# EAGLE design STM32DiscoveryValueLine (EAGLE 6.4)
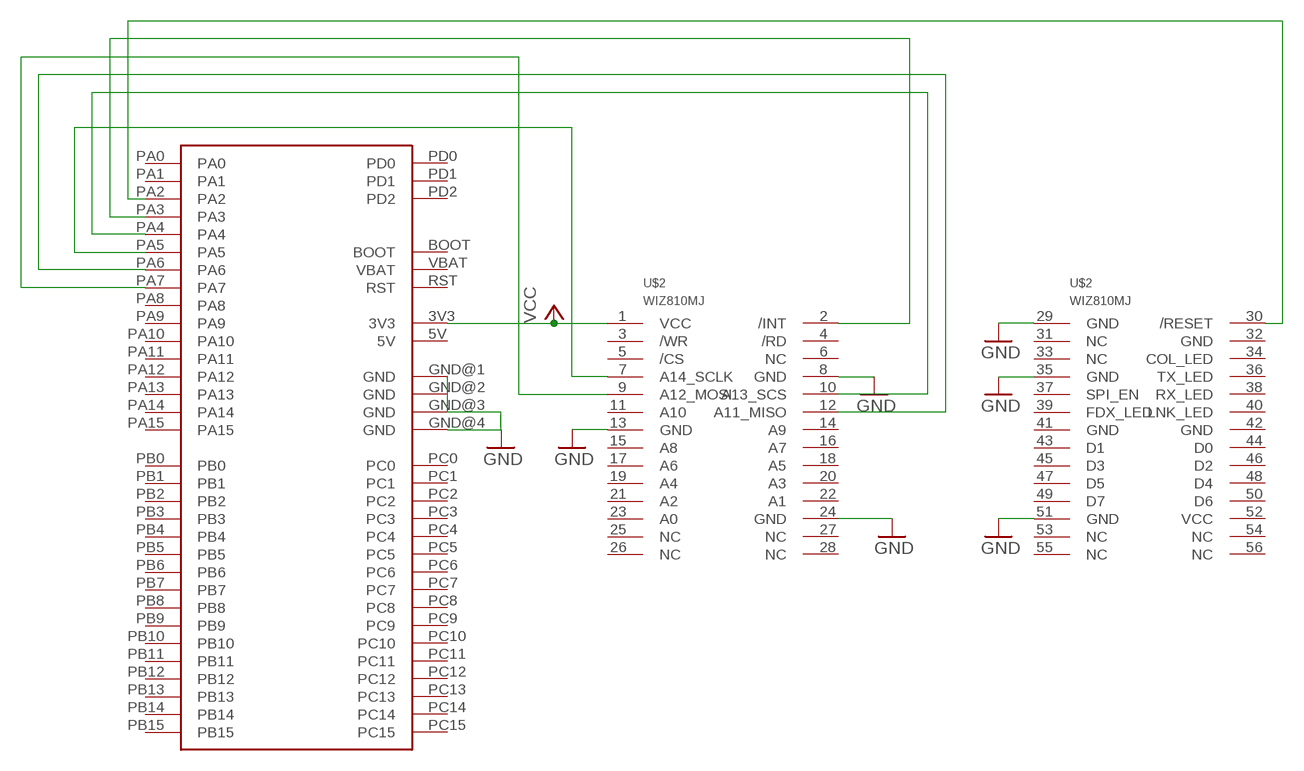
[diagram p0: schematic, sheet 1]

## Parts
U$1  STM32_DISCOVERY  [STM32_DISCOVERY]
U$2  WIZ810MJ  [WIZ810MJ]

## Nets
GND: U$1.GND@1(GND) U$1.GND@2(GND) U$1.GND@3(GND) U$1.GND@4(GND) U$2.8(GND) U$2.13(GND) U$2.24(GND) U$2.29(GND) U$2.35(GND) U$2.51(GND)
N$1: U$1.PA4 U$2.10(A13_SCS)
N$2: U$1.PA5 U$2.7(A14_SCLK)
N$3: U$1.PA6 U$2.12(A11_MISO)
N$4: U$1.PA7 U$2.9(A12_MOSI)
N$5: U$1.PA3 U$2.2(/INT)
N$6: U$1.PA2 U$2.30(/RESET)
VCC: U$1.3V3 U$2.1(VCC)
Unconnected: U$1.5V U$1.BOOT U$1.NC@1(NC) U$1.NC@2(NC) U$1.PA0 U$1.PA1 U$1.PA8 U$1.PA9 U$1.PA10 U$1.PA11 U$1.PA12 U$1.PA13 U$1.PA14 U$1.PA15 U$1.PB0 U$1.PB1 U$1.PB2 U$1.PB3 U$1.PB4 U$1.PB5 U$1.PB6 U$1.PB7 U$1.PB8 U$1.PB9 U$1.PB10 U$1.PB11 U$1.PB12 U$1.PB13 U$1.PB14 U$1.PB15 U$1.PC0 U$1.PC1 U$1.PC2 U$1.PC3 U$1.PC4 U$1.PC5 U$1.PC6 U$1.PC7 U$1.PC8 U$1.PC9 U$1.PC10 U$1.PC11 U$1.PC12 U$1.PC13 U$1.PC14 U$1.PC15 U$1.PD0 U$1.PD1 U$1.PD2 U$1.RST U$1.VBAT U$2.3(/WR) U$2.4(/RD) U$2.5(/CS) U$2.6(NC) U$2.11(A10) U$2.14(A9) U$2.15(A8) U$2.16(A7) U$2.17(A6) U$2.18(A5) U$2.19(A4) U$2.20(A3) U$2.21(A2) U$2.22(A1) U$2.23(A0) U$2.25(NC) U$2.26(NC) U$2.27(NC) U$2.28(NC) U$2.31(NC) U$2.32(GND) U$2.33(NC) U$2.34(COL_LED) U$2.36(TX_LED) U$2.37(SPI_EN) U$2.38(RX_LED) U$2.39(FDX_LED) U$2.40(LNK_LED) U$2.41(GND) U$2.42(GND) U$2.43(D1) U$2.44(D0) U$2.45(D3) U$2.46(D2) U$2.47(D5) U$2.48(D4) U$2.49(D7) U$2.50(D6) U$2.52(VCC) U$2.53(NC) U$2.54(NC) U$2.55(NC) U$2.56(NC)

## Library data of the parts
U$1 = stm32_discovery:STM32_DISCOVERY: STM32 Value line discovery
U$2 = WIZNET:WIZ810MJ

## Board
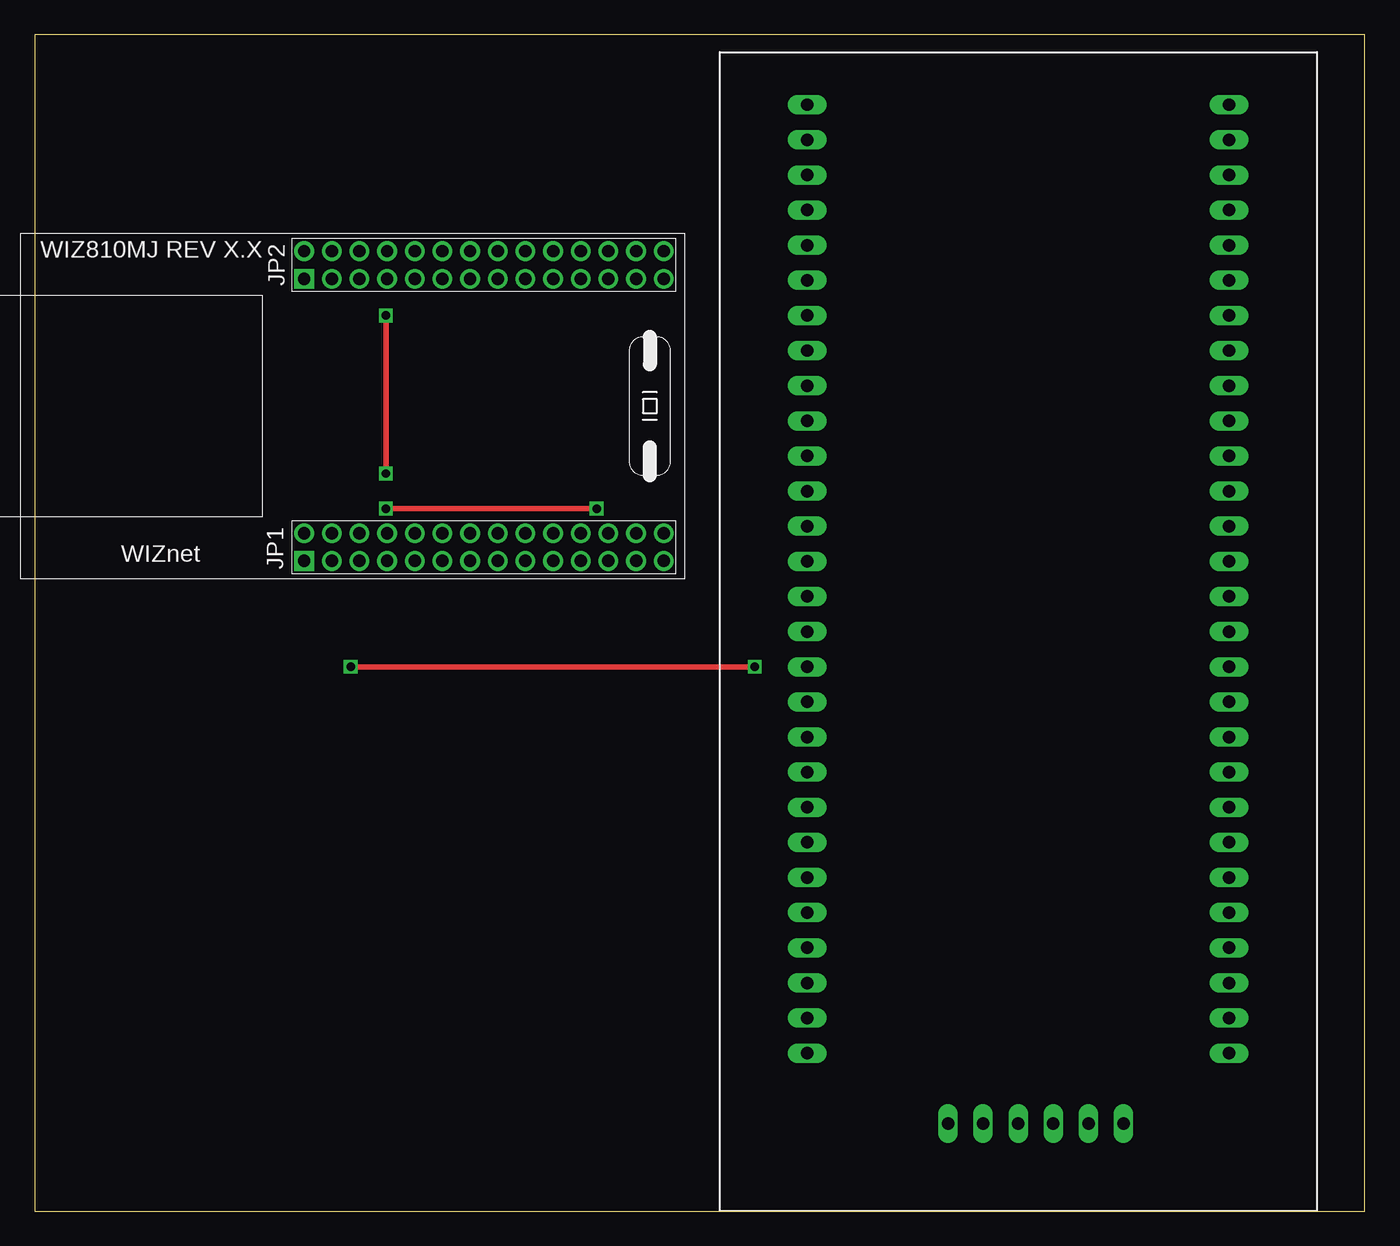
[diagram p1: board, top side]
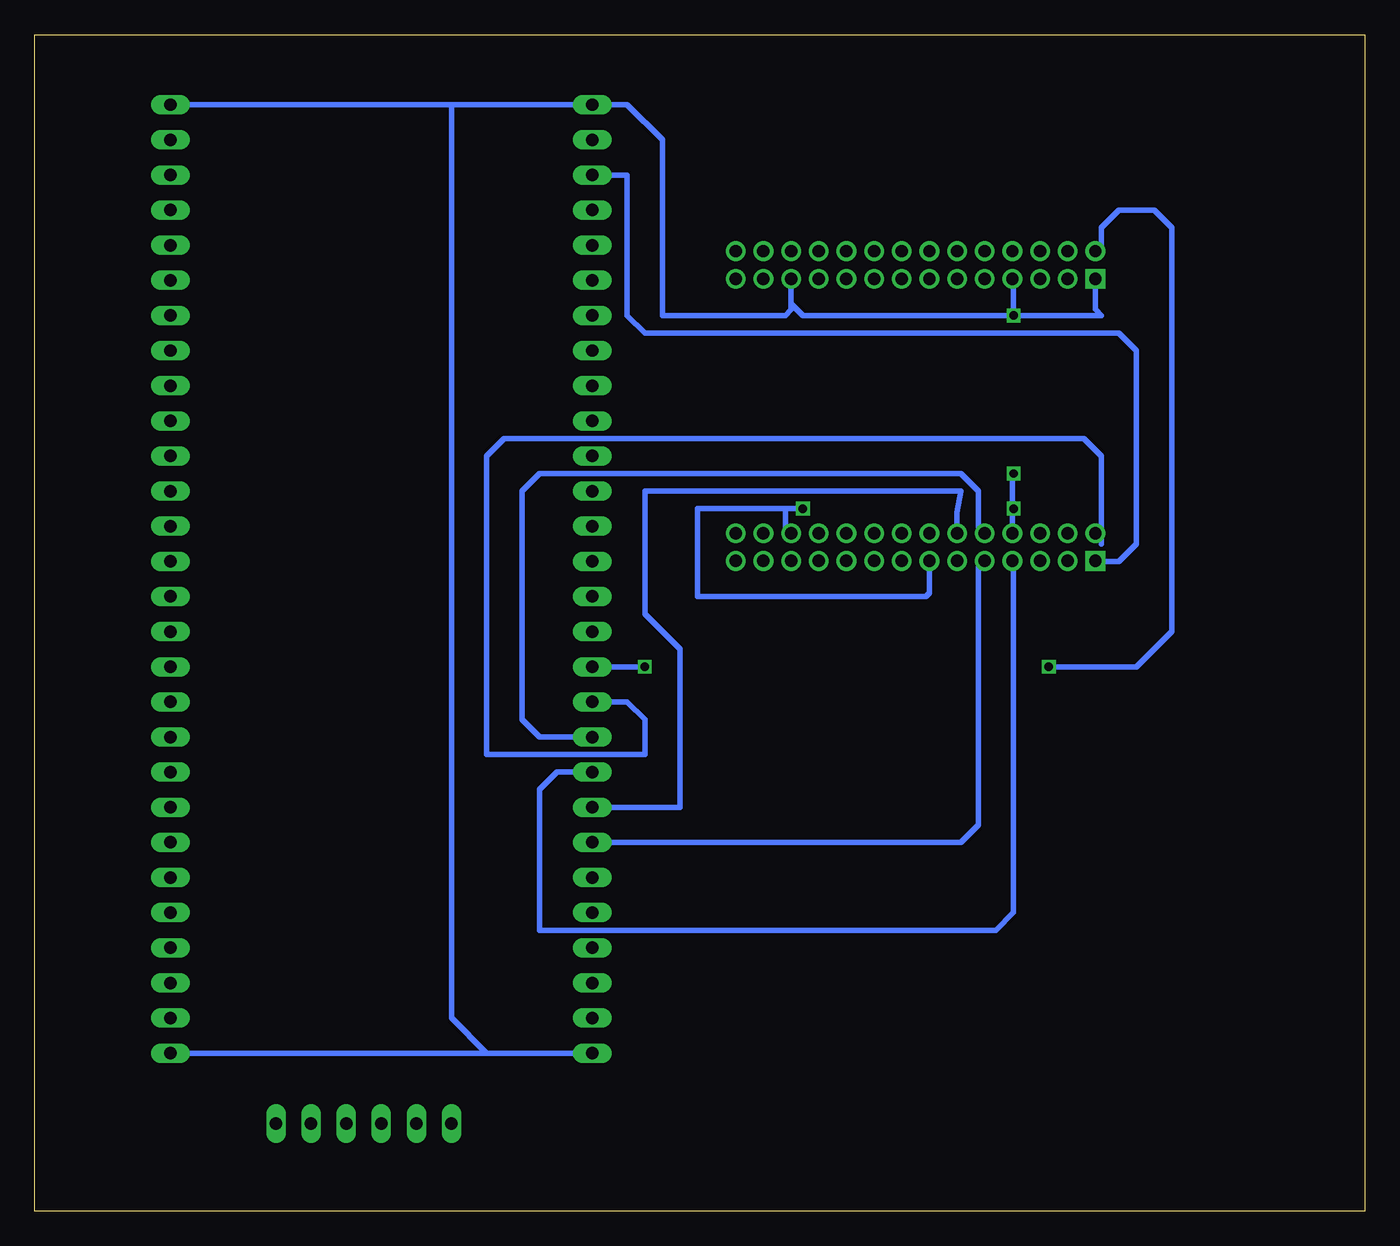
[diagram p2: board, bottom side, seen from below]

Size 96.19 x 85.08 mm. Coordinates in mm from the lower left corner, seen from the top.
Outline: 0,0 96.19,0 96.19,85.08 0,85.08 0,0
Copper layers (1*16): Top 0.035mm / dielectric 1.5mm / Bottom 0.035mm
Design rules "default": minimum track width 10mil, minimum drill 24mil, track to track 8mil, track to pad 8mil, pad to pad 8mil, via to via 8mil, smd to smd 8mil, copper to edge 40mil, drill to drill 8mil, minimum pad ring 10mil, minimum via ring 8mil, stop-mask expansion 4mil, vias tented up to drill 0mil, thermal gap 10mil

### Footprints (pad centres in the part's own frame; a part is rotated, then mirrored left to right if it is on the bottom)
STM32_DISCOVERY = drill 0.9 long: 3V3 -15.24,29.21; 5V 15.24,29.21; BOOT 15.24,21.59; GND@1 -15.24,34.29; GND@2 15.24,34.29; GND@3 -15.24,-34.29; GND@4 15.24,-34.29; NC@1 -15.24,31.75; NC@2 15.24,31.75; PA0 -15.24,-1.27; PA1 -15.24,-3.81; PA2 -15.24,-6.35; PA3 -15.24,-8.89; PA4 -15.24,-11.43; PA5 -15.24,-13.97; PA6 -15.24,-16.51; PA7 -15.24,-19.05; PA8 15.24,-21.59; PA9 15.24,-19.05; PA10 15.24,-16.51; PA11 15.24,-13.97; PA12 15.24,-11.43; PA13 15.24,-8.89; PA14 15.24,-6.35; PA15 15.24,-3.81; PB0 -15.24,-26.67; PB1 -15.24,-29.21; PB2 -15.24,-31.75; PB3 15.24,8.89; PB4 15.24,11.43; PB5 15.24,13.97; PB6 15.24,16.51; PB7 15.24,19.05; PB8 15.24,24.13; PB9 15.24,26.67; PB10 -5.08,-39.37; PB11 -2.54,-39.37; PB12 0,-39.37; PB13 2.54,-39.37; PB14 5.08,-39.37; PB15 7.62,-39.37; PC0 -15.24,8.89; PC1 -15.24,6.35; PC2 -15.24,3.81; PC3 -15.24,1.27; PC4 -15.24,-21.59; PC5 -15.24,-24.13; PC6 15.24,-31.75; PC7 15.24,-29.21; PC8 15.24,-26.67; PC9 15.24,-24.13; PC10 15.24,-1.27; PC11 15.24,1.27; PC12 15.24,3.81; PC13 -15.24,24.13; PC14 -15.24,21.59; PC15 -15.24,19.05; PD0 -15.24,16.51; PD1 -15.24,13.97; PD2 15.24,6.35; RST -15.24,11.43; VBAT -15.24,26.67
WIZ810MJ = drill 0.9 pad 1.422 square: 1 27.5,-1.3; 29 27.5,-21.7 | drill 0.9 pad 1.422: 2 27.5,-3.3; 3 25.5,-1.3; 4 25.5,-3.3; 5 23.5,-1.3; 6 23.5,-3.3; 7 21.5,-1.3; 8 21.5,-3.3; 9 19.5,-1.3; 10 19.5,-3.3; 11 17.5,-1.3; 12 17.5,-3.3; 13 15.5,-1.3; 14 15.5,-3.3; 15 13.5,-1.3; 16 13.5,-3.3; 17 11.5,-1.3; 18 11.5,-3.3; 19 9.5,-1.3; 20 9.5,-3.3; 21 7.5,-1.3; 22 7.5,-3.3; 23 5.5,-1.3; 24 5.5,-3.3; 25 3.5,-1.3; 26 3.5,-3.3; 27 1.5,-1.3; 28 1.5,-3.3; 30 27.5,-23.7; 31 25.5,-21.7; 32 25.5,-23.7; 33 23.5,-21.7; 34 23.5,-23.7; 35 21.5,-21.7; 36 21.5,-23.7; 37 19.5,-21.7; 38 19.5,-23.7; 39 17.5,-21.7; 40 17.5,-23.7; 41 15.5,-21.7; 42 15.5,-23.7; 43 13.5,-21.7; 44 13.5,-23.7; 45 11.5,-21.7; 46 11.5,-23.7; 47 9.5,-21.7; 48 9.5,-23.7; 49 7.5,-21.7; 50 7.5,-23.7; 51 5.5,-21.7; 52 5.5,-23.7; 53 3.5,-21.7; 54 3.5,-23.7; 55 1.5,-21.7; 56 1.5,-23.7

### Placement (x,y rotation side)
U$1  71.12,45.72 0 top
U$2  46.99,45.72 180 top

### Tracks (layer width: path | path; a pad name or v marks a point on that pad's centre or on a via)
GND  (via drill 0.6)
  Top 0.406: v25.4,53.34 v25.4,64.77 | v25.4,50.8 v40.64,50.8
  Bottom 0.406: v25.4,64.77 40.64,64.77 41.49,65.62 U$2.51 41.49,65.19 41.91,64.77 50.8,64.77 50.8,77.47 53.34,80.01 U$1.GND@1 66.04,80.01 | v25.4,64.77 25.4,67.33 U$2.35 | U$2.29 19.49,65.21 19.05,64.77 v25.4,64.77 | 66.04,80.01 U$1.GND@2 | U$1.GND@4 U$1.GND@3 63.5,11.43 66.04,13.97 66.04,80.01 | v25.4,53.34 25.49,53.25 U$2.8 25.49,50.71 v25.4,50.8 | U$2.13 31.49,44.71 31.75,44.45 48.26,44.45 48.26,50.8 41.91,50.8 | 41.91,50.8 41.91,49.44 U$2.24 | v40.64,50.8 41.91,50.8
N$1
  Bottom 0.406: U$1.PA4 59.69,34.29 60.96,35.56 60.96,52.07 59.69,53.34 29.21,53.34 27.94,52.07 27.94,49.47 U$2.10
N$2
  Bottom 0.406: U$1.PA5 58.42,31.75 59.69,30.48 59.69,20.32 26.67,20.32 25.4,21.59 25.4,46.93 U$2.7
N$3
  Bottom 0.406: U$2.12 29.49,50.52 29.21,52.07 52.07,52.07 52.07,43.18 49.53,40.64 49.53,29.21 U$1.PA6
N$4
  Bottom 0.406: U$1.PA7 29.21,26.67 27.94,27.94 27.94,46.57 U$2.9
N$5
  Bottom 0.406: U$1.PA3 53.34,36.83 52.07,35.56 52.07,33.02 63.5,33.02 63.5,54.61 62.23,55.88 20.32,55.88 19.05,54.61 19.05,48.58 | 19.05,48.26 19.05,48.58 | 19.05,48.58 U$2.2
N$6  (via drill 0.6)
  Top 0.406: v52.07,39.37 v22.86,39.37
  Bottom 0.406: U$1.PA2 v52.07,39.37 | v22.86,39.37 16.51,39.37 13.97,41.91 13.97,71.12 15.24,72.39 17.78,72.39 19.05,71.12 19.05,69.86 U$2.30
VCC
  Bottom 0.406: U$1.3V3 53.34,74.93 53.34,64.77 52.07,63.5 17.78,63.5 16.51,62.23 16.51,48.26 17.78,46.99 19.46,46.99 U$2.1